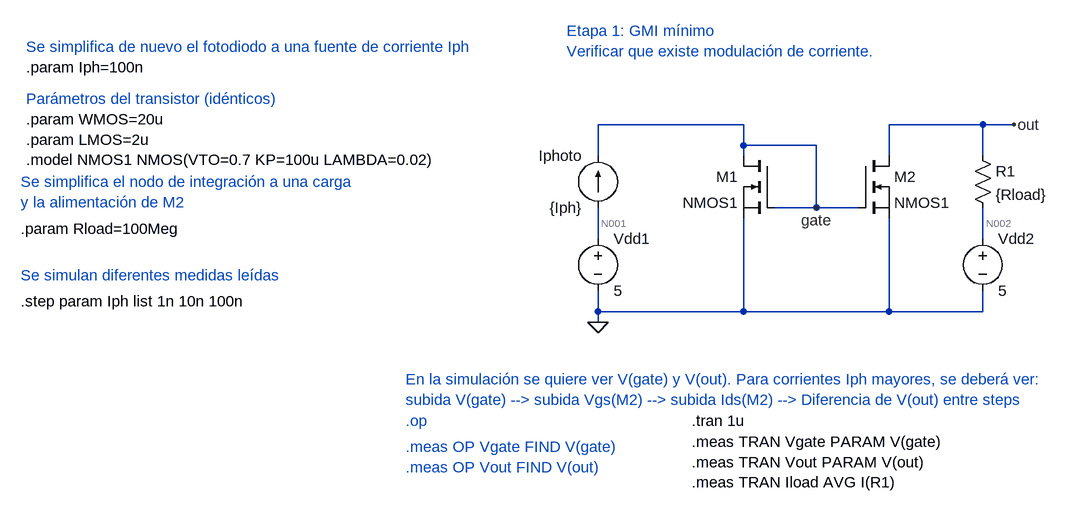
[diagram p0: schematic GMI_Etapa1.asc]
GMI_Etapa1.asc, the LTspice schematic file:
Version 4.1
SHEET 1 1112 816
WIRE 336 224 112 224
WIRE 704 224 560 224
WIRE 752 224 704 224
WIRE 336 256 336 224
WIRE 448 256 336 256
WIRE 112 272 112 224
WIRE 336 272 336 256
WIRE 560 272 560 224
WIRE 704 272 704 224
WIRE 448 352 448 256
WIRE 448 352 384 352
WIRE 512 352 448 352
WIRE 112 400 112 352
WIRE 704 400 704 352
WIRE 112 512 112 480
WIRE 336 512 336 368
WIRE 336 512 112 512
WIRE 560 512 560 368
WIRE 560 512 336 512
WIRE 704 512 704 480
WIRE 704 512 560 512
WIRE 112 528 112 512
FLAG 112 528 0
FLAG 752 224 out
FLAG 448 352 gate
SYMBOL voltage 112 384 R0
WINDOW 123 0 0 Left 0
WINDOW 39 0 0 Left 0
SYMATTR InstName Vdd1
SYMATTR Value 5
SYMBOL current 112 352 R180
WINDOW 0 24 80 Left 2
WINDOW 3 24 0 Left 2
SYMATTR InstName Iphoto
SYMATTR Value {Iph}
SYMBOL nmos 384 272 M0
SYMATTR InstName M1
SYMATTR Value NMOS1
SYMATTR SpiceLine L={LMOS} W={WMOS}
SYMBOL nmos 512 272 R0
SYMATTR InstName M2
SYMATTR Value NMOS1
SYMATTR SpiceLine L={LMOS} W={WMOS}
SYMBOL res 688 256 R0
SYMATTR InstName R1
SYMATTR Value {Rload}
SYMBOL voltage 704 384 R0
WINDOW 123 0 0 Left 0
WINDOW 39 0 0 Left 0
SYMATTR InstName Vdd2
SYMATTR Value 5
TEXT 64 80 Left 2 ;Etapa 1: GMI mínimo\nVerificar que existe modulación de corriente.
TEXT -768 216 Left 2 !.param WMOS=20u\n.param LMOS=2u\n.model NMOS1 NMOS(VTO=0.7 KP=100u LAMBDA=0.02)
TEXT -776 496 Left 2 !.step param Iph list 1n 10n 100n
TEXT -776 384 Left 2 !.param Rload=100Meg
TEXT -768 184 Left 2 ;Parámetros del transistor (idénticos)
TEXT -768 104 Left 2 ;Se simplifica de nuevo el fotodiodo a una fuente de corriente Iph
TEXT -768 136 Left 2 !.param Iph=100n
TEXT -776 312 Left 2 ;Se simplifica el nodo de integración a una carga \ny la alimentación de M2
TEXT -184 616 Left 2 ;En la simulación se quiere ver V(gate) y V(out). Para corrientes Iph mayores, se deberá ver: \nsubida V(gate) --> subida Vgs(M2) --> subida Ids(M2) --> Diferencia de V(out) entre steps
TEXT -184 680 Left 2 ;.op
TEXT -184 720 Left 2 ;.meas OP Vgate FIND V(gate)\n.meas OP Vout FIND V(out)
TEXT -776 456 Left 2 ;Se simulan diferentes medidas leídas
TEXT 256 712 Left 2 !.meas TRAN Vgate PARAM V(gate)\n.meas TRAN Vout PARAM V(out)\n.meas TRAN Iload AVG I(R1)
TEXT 256 680 Left 2 !.tran 1u

The netlist it stands for:
* GMI_Etapa1.asc
Vdd1 N001 0 5
Iphoto N001 gate {Iph}
M1 gate gate 0 0 NMOS1 L={LMOS} W={WMOS}
M2 out gate 0 0 NMOS1 L={LMOS} W={WMOS}
R1 out N002 {Rload}
Vdd2 N002 0 5
.model NMOS NMOS
.model PMOS PMOS
.lib standard.mos
* Etapa 1: GMI mínimo
* Verificar que existe modulación de corriente.
.param WMOS=20u
.param LMOS=2u
.model NMOS1 NMOS(VTO=0.7 KP=100u LAMBDA=0.02)
.step param Iph list 1n 10n 100n
.param Rload=100Meg
* Parámetros del transistor (idénticos)
* Se simplifica de nuevo el fotodiodo a una fuente de corriente Iph
.param Iph=100n
* Se simplifica el nodo de integración a una carga
* y la alimentación de M2
* En la simulación se quiere ver V(gate) y V(out). Para corrientes Iph mayores, se deberá ver:
* subida V(gate) --> subida Vgs(M2) --> subida Ids(M2) --> Diferencia de V(out) entre steps
* .op
* .meas OP Vgate FIND V(gate)
* .meas OP Vout FIND V(out)
* Se simulan diferentes medidas leídas
.meas TRAN Vgate PARAM V(gate)
.meas TRAN Vout PARAM V(out)
.meas TRAN Iload AVG I(R1)
.tran 1u
.backanno
.end

* Results of the author's LTspice run, read from the files saved beside the schematic
* Operating Point (first step), zero values left out:
*   V(gate) = 704.4 mV
*   V(n001) = 5 V
*   V(n002) = 5 V
*   V(out) = 4.891 V
*   I(Iphoto) = 1 nA
*   I(R1) = -1.091 nA
*   I(Vdd1) = -1 nA
*   I(Vdd2) = -1.091 nA
*   Ib(M2) = -4.901 pA
*   Id(M1) = 1.001 nA
*   Id(M2) = 1.092 nA
*   Is(M1) = -1 nA
*   Is(M2) = -1.087 nA
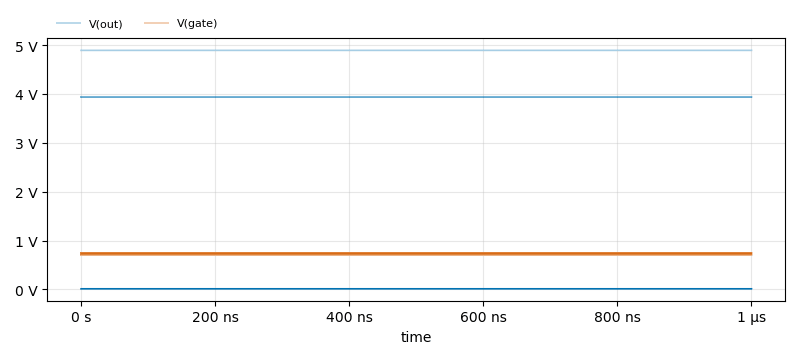
[diagram p1: Transient Analysis of GMI_Etapa1.asc, plotted from the saved traces]
* Transient Analysis, 3 runs:
*   V(out) [iph=1e-09]: min 4.891 V, max 4.891 V, average 4.891 V, rms 4.891 V, last 4.891 V
*   V(out) [iph=1e-08]: min 3.936 V, max 3.936 V, average 3.936 V, rms 3.936 V, last 3.936 V
*   V(out) [iph=1e-07]: min 13.19 mV, max 13.19 mV, average 13.19 mV, rms 13.19 mV, last 13.19 mV
*   V(gate) [iph=1e-09]: min 704.4 mV, max 704.4 mV, average 704.4 mV, rms 704.4 mV, last 704.4 mV
*   V(gate) [iph=1e-08]: min 714 mV, max 714 mV, average 714 mV, rms 714 mV, last 714 mV
*   V(gate) [iph=1e-07]: min 744.4 mV, max 744.4 mV, average 744.4 mV, rms 744.4 mV, last 744.4 mV
* From the log:
*   Measurement: vgate
*     step  V(gate)
*        1  0.704437792301
*        2  0.714041233063
*        3  0.744391798973
*   Measurement: vout
*     step  V(out)
*        1  4.89091777802
*        2  3.93583607674
*        3  0.0131903011352
*   Measurement: iload
*     step  AVG(I(R1))  FROM  TO
*        1  -1.09082209931e-09  0  1e-06
*        2  -1.06416386814e-08  0  1e-06
*        3  -4.98680954308e-08  0  1e-06